# Altium schematic sheet bb_Nucleo.SchDoc
size A4; SheetNumber: 1; SheetTotal: 6
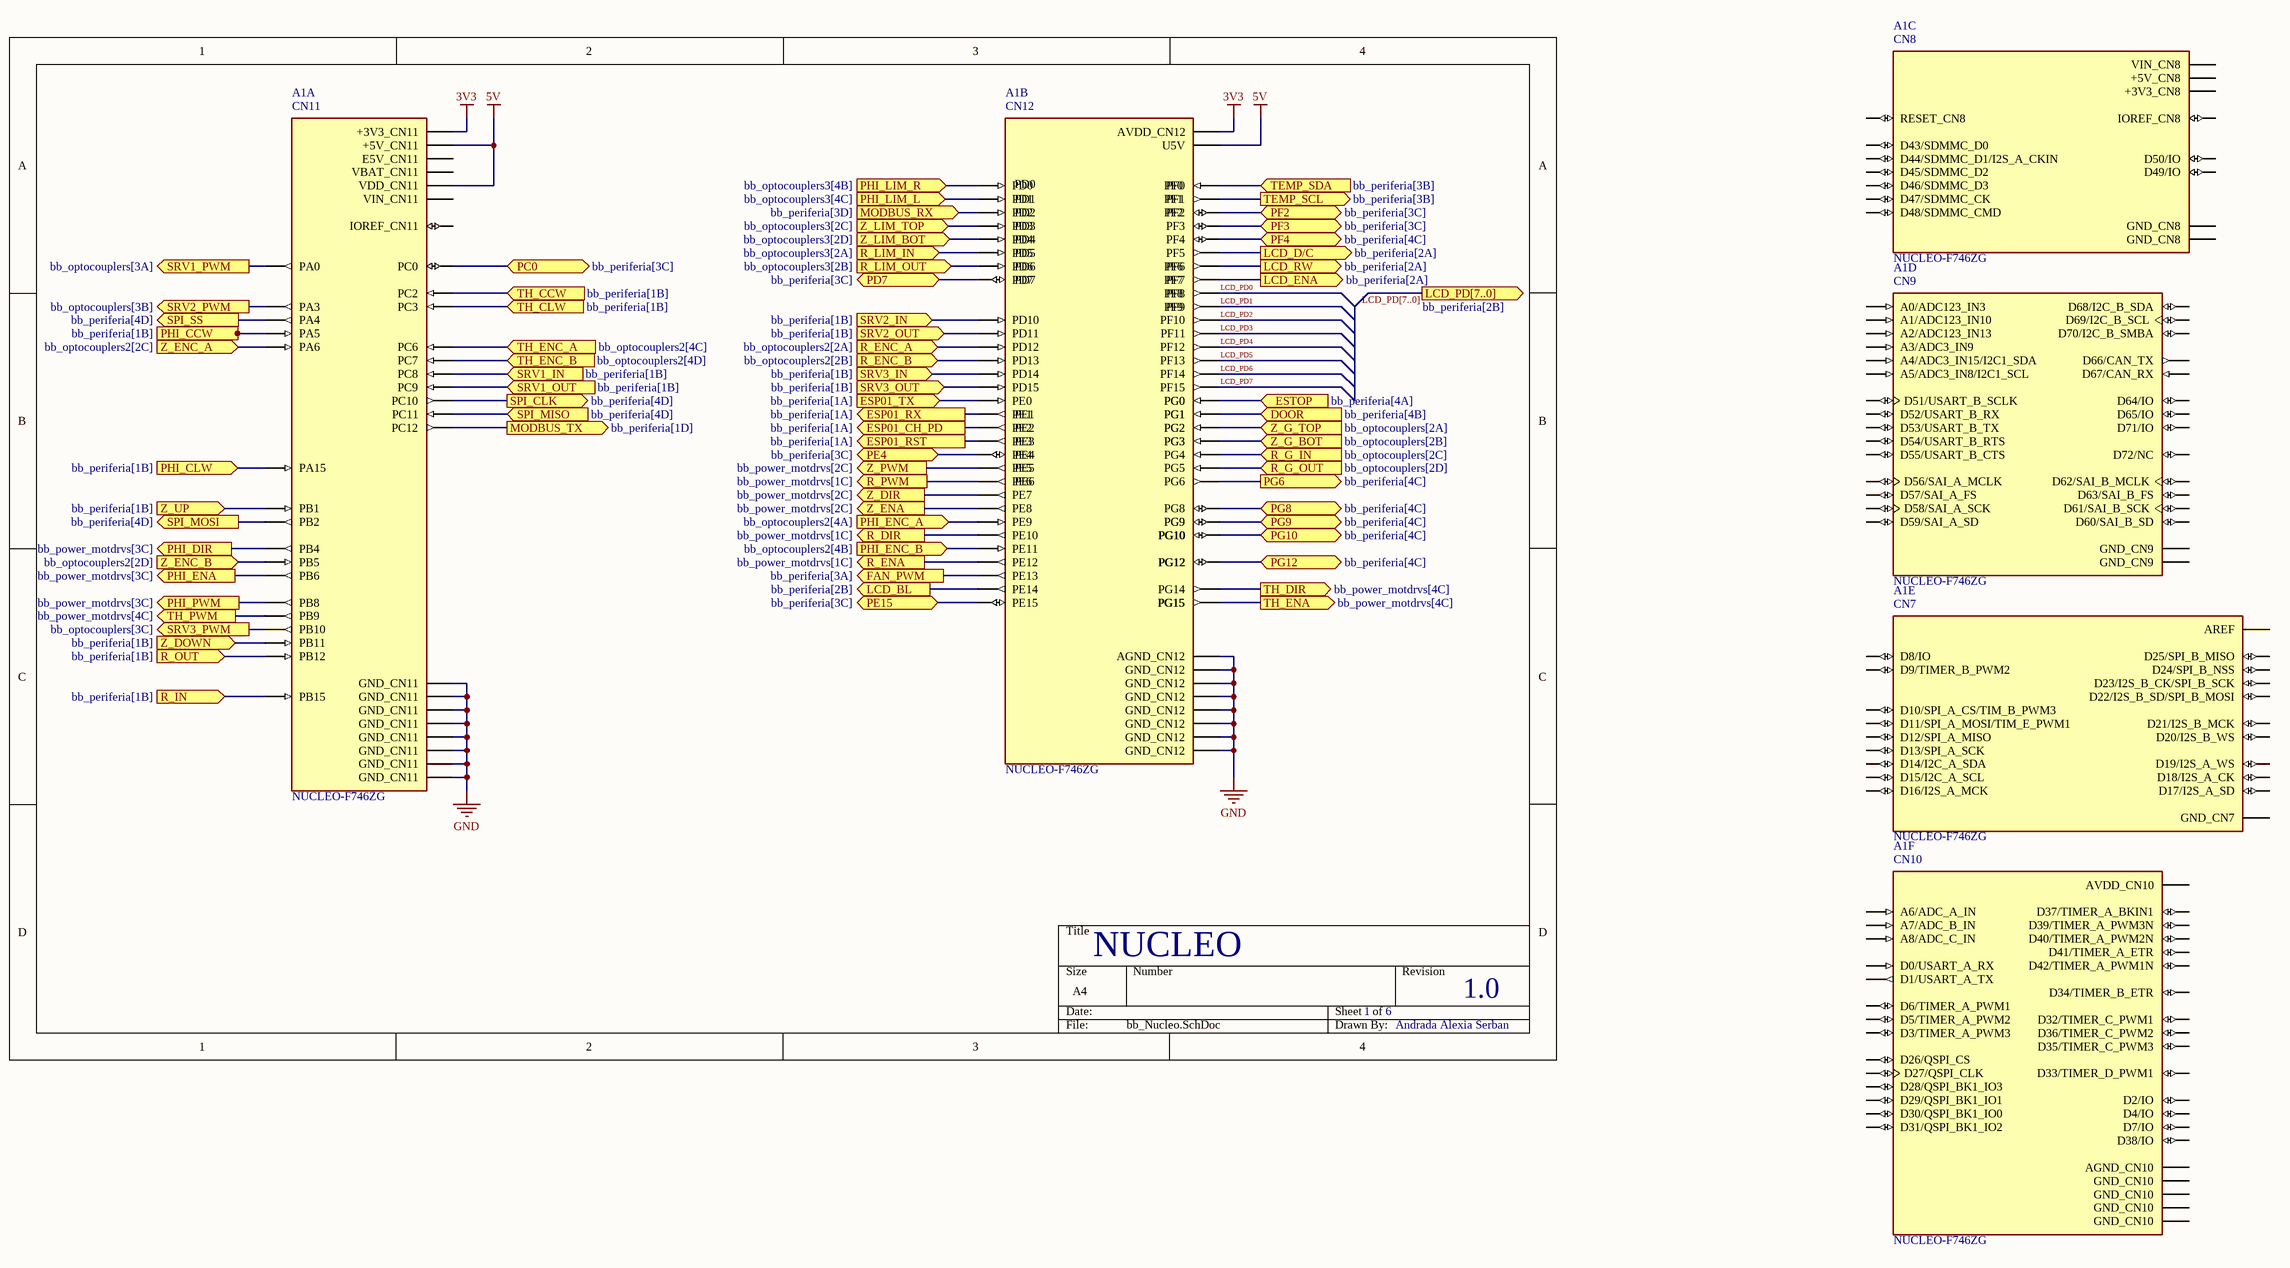
[diagram p0: bb_Nucleo.SchDoc]

## Parts
A1  NUCLEO-F746ZG  [MODULE_NUCLEO-F746ZG]  (parts A,B,C,D,E,F of 6)

## Ports
DOOR (in, see bb_periferia[4B]), ESP01_CH_PD (out, see bb_periferia[1A]), ESP01_RST (out, see bb_periferia[1A]), ESP01_RX (out, see bb_periferia[1A]), ESP01_TX (in, see bb_periferia[1A]), ESTOP (in, see bb_periferia[4A]), FAN_PWM (out, see bb_periferia[3A]), LCD_BL (out, see bb_periferia[2B]), LCD_D/C (out, see bb_periferia[2A]), LCD_ENA (out, see bb_periferia[2A]), LCD_PD[7..0] (out, see bb_periferia[2B]), LCD_RW (out, see bb_periferia[2A]), MODBUS_RX (in, see bb_periferia[3D]), MODBUS_TX (out, see bb_periferia[1D]), PC0 (bidir, see bb_periferia[3C]), PD7 (bidir, see bb_periferia[3C]), PE4 (bidir, see bb_periferia[3C]), PE15 (bidir, see bb_periferia[3C]), PF2 (bidir, see bb_periferia[3C]), PF3 (bidir, see bb_periferia[3C]), PF4 (bidir, see bb_periferia[4C]), PG6 (out, see bb_periferia[4C]), PG8 (bidir, see bb_periferia[4C]), PG9 (bidir, see bb_periferia[4C]), PG10 (bidir, see bb_periferia[4C]), PG12 (bidir, see bb_periferia[4C]), PHI_CCW (in, see bb_periferia[1B]), PHI_CLW (in, see bb_periferia[1B]), PHI_DIR (out, see bb_power_motdrvs[3C]), PHI_ENA (out, see bb_power_motdrvs[3C]), PHI_ENC_A (in, see bb_optocouplers2[4A]), PHI_ENC_B (in, see bb_optocouplers2[4B]), PHI_LIM_L (in, see bb_optocouplers3[4C]), PHI_LIM_R (in, see bb_optocouplers3[4B]), PHI_PWM (out, see bb_power_motdrvs[3C]), R_DIR (out, see bb_power_motdrvs[1C]), R_ENA (out, see bb_power_motdrvs[1C]), R_ENC_A (in, see bb_optocouplers2[2A]), R_ENC_B (in, see bb_optocouplers2[2B]), R_G_IN (in, see bb_optocouplers[2C]), R_G_OUT (in, see bb_optocouplers[2D]), R_IN (in, see bb_periferia[1B]), R_LIM_IN (in, see bb_optocouplers3[2A]), R_LIM_OUT (in, see bb_optocouplers3[2B]), R_OUT (in, see bb_periferia[1B]), R_PWM (out, see bb_power_motdrvs[1C]), SPI_CLK (out, see bb_periferia[4D]), SPI_MISO (in, see bb_periferia[4D]), SPI_MOSI (out, see bb_periferia[4D]), SPI_SS (out, see bb_periferia[4D]), SRV1_IN (in, see bb_periferia[1B]), SRV1_OUT (in, see bb_periferia[1B]), SRV1_PWM (out, see bb_optocouplers[3A]), SRV2_IN (in, see bb_periferia[1B]), SRV2_OUT (in, see bb_periferia[1B]), SRV2_PWM (out, see bb_optocouplers[3B]), SRV3_IN (in, see bb_periferia[1B]), SRV3_OUT (in, see bb_periferia[1B]), SRV3_PWM (out, see bb_optocouplers[3C]), TEMP_SCL (out, see bb_periferia[3B]), TEMP_SDA (in, see bb_periferia[3B]), TH_CCW (in, see bb_periferia[1B]), TH_CLW (in, see bb_periferia[1B]), TH_DIR (out, see bb_power_motdrvs[4C]), TH_ENA (out, see bb_power_motdrvs[4C]), TH_ENC_A (in, see bb_optocouplers2[4C]), TH_ENC_B (in, see bb_optocouplers2[4D]), TH_PWM (out, see bb_power_motdrvs[4C]), Z_DIR (out, see bb_power_motdrvs[2C]), Z_DOWN (in, see bb_periferia[1B]), Z_ENA (out, see bb_power_motdrvs[2C]), Z_ENC_A (in, see bb_optocouplers2[2C]), Z_ENC_B (in, see bb_optocouplers2[2D]), Z_G_BOT (in, see bb_optocouplers[2B]), Z_G_TOP (in, see bb_optocouplers[2A]), Z_LIM_BOT (in, see bb_optocouplers3[2D]), Z_LIM_TOP (in, see bb_optocouplers3[2C]), Z_PWM (out, see bb_power_motdrvs[2C]), Z_UP (in, see bb_periferia[1B])

## Nets
3V3: A1.CN11_16(+3V3_CN11) A1.CN12_7(AVDD_CN12)
5V: A1.CN11_5(VDD_CN11) A1.CN11_18(+5V_CN11) A1.CN12_8(U5V)
GND: A1.CN11_8(GND_CN11) A1.CN11_19(GND_CN11) A1.CN11_20(GND_CN11) A1.CN11_22(GND_CN11) A1.CN11_49(GND_CN11) A1.CN11_60(GND_CN11) A1.CN11_71(GND_CN11) A1.CN11_72(GND_CN11) A1.CN12_9(GND_CN12) A1.CN12_20(GND_CN12) A1.CN12_32(AGND_CN12) A1.CN12_39(GND_CN12) A1.CN12_54(GND_CN12) A1.CN12_63(GND_CN12) A1.CN12_71(GND_CN12) A1.CN12_72(GND_CN12)
DOOR: A1.CN11_58(PG1) ; port DOOR
ESP01_CH_PD: A1.CN11_46(PE2) ; port ESP01_CH_PD
ESP01_RST: A1.CN11_47(PE3) ; port ESP01_RST
ESP01_RX: A1.CN11_61(PE1) ; port ESP01_RX
ESP01_TX: A1.CN12_64(PE0) ; port ESP01_TX
ESTOP: A1.CN11_59(PG0) ; port ESTOP
FAN_PWM: A1.CN12_55(PE13) ; port FAN_PWM
LCD_BL: A1.CN12_51(PE14) ; port LCD_BL
LCD_D/C: A1.CN12_36(PF5) ; port LCD_D/C
LCD_ENA: A1.CN11_11(PF7) ; port LCD_ENA
LCD_PD0: A1.CN11_54(PF8)
LCD_PD1: A1.CN11_56(PF9)
LCD_PD2: A1.CN12_42(PF10)
LCD_PD3: A1.CN12_62(PF11)
LCD_PD4: A1.CN12_59(PF12)
LCD_PD5: A1.CN12_57(PF13)
LCD_PD6: A1.CN12_50(PF14)
LCD_PD7: A1.CN12_60(PF15)
LCD_RW: A1.CN11_9(PF6) ; port LCD_RW
MODBUS_RX: A1.CN11_4(PD2) ; port MODBUS_RX
MODBUS_TX: A1.CN11_3(PC12) ; port MODBUS_TX
PC0: A1.CN11_38(PC0) ; port PC0
PD7: A1.CN11_45(PD7) ; port PD7
PE4: A1.CN11_48(PE4) ; port PE4
PE15: A1.CN12_53(PE15) ; port PE15
PF2: A1.CN11_52(PF2) ; port PF2
PF3: A1.CN12_58(PF3) ; port PF3
PF4: A1.CN12_38(PF4) ; port PF4
PG6: A1.CN12_70(PG6) ; port PG6
PG8: A1.CN12_66(PG8) ; port PG8
PG9: A1.CN11_63(PG9) ; port PG9
PG10: A1.CN11_66(PG10) ; port PG10
PG12: A1.CN11_65(PG12) ; port PG12
PHI_CCW: A1.CN12_11(PA5) ; port PHI_CCW
PHI_CLW: A1.CN11_17(PA15) ; port PHI_CLW
PHI_DIR: A1.CN12_27(PB4) ; port PHI_DIR
PHI_ENA: A1.CN12_17(PB6) ; port PHI_ENA
PHI_ENC_A: A1.CN12_52(PE9) ; port PHI_ENC_A
PHI_ENC_B: A1.CN12_56(PE11) ; port PHI_ENC_B
PHI_LIM_L: A1.CN11_55(PD1) ; port PHI_LIM_L
PHI_LIM_R: A1.CN11_57(PD0) ; port PHI_LIM_R
PHI_PWM: A1.CN12_3(PB8) ; port PHI_PWM
R_DIR: A1.CN12_47(PE10) ; port R_DIR
R_ENA: A1.CN12_49(PE12) ; port R_ENA
R_ENC_A: A1.CN12_43(PD12) ; port R_ENC_A
R_ENC_B: A1.CN12_41(PD13) ; port R_ENC_B
R_G_IN: A1.CN12_69(PG4) ; port R_G_IN
R_G_OUT: A1.CN12_68(PG5) ; port R_G_OUT
R_IN: A1.CN12_26(PB15) ; port R_IN
R_LIM_IN: A1.CN11_41(PD5) ; port R_LIM_IN
R_LIM_OUT: A1.CN11_43(PD6) ; port R_LIM_OUT
R_OUT: A1.CN12_16(PB12) ; port R_OUT
R_PWM: A1.CN11_62(PE6) ; port R_PWM
SPI_CLK: A1.CN11_1(PC10) ; port SPI_CLK
SPI_MISO: A1.CN11_2(PC11) ; port SPI_MISO
SPI_MOSI: A1.CN12_22(PB2) ; port SPI_MOSI
SPI_SS: A1.CN11_32(PA4) ; port SPI_SS
SRV1_IN: A1.CN12_2(PC8) ; port SRV1_IN
SRV1_OUT: A1.CN12_1(PC9) ; port SRV1_OUT
SRV1_PWM: A1.CN11_28(PA0) ; port SRV1_PWM
SRV2_IN: A1.CN12_65(PD10) ; port SRV2_IN
SRV2_OUT: A1.CN12_45(PD11) ; port SRV2_OUT
SRV2_PWM: A1.CN12_37(PA3) ; port SRV2_PWM
SRV3_IN: A1.CN12_46(PD14) ; port SRV3_IN
SRV3_OUT: A1.CN12_48(PD15) ; port SRV3_OUT
SRV3_PWM: A1.CN12_25(PB10) ; port SRV3_PWM
TEMP_SCL: A1.CN11_51(PF1) ; port TEMP_SCL
TEMP_SDA: A1.CN11_53(PF0) ; port TEMP_SDA
TH_CCW: A1.CN11_35(PC2) ; port TH_CCW
TH_CLW: A1.CN11_37(PC3) ; port TH_CLW
TH_DIR: A1.CN12_61(PG14) ; port TH_DIR
TH_ENA: A1.CN11_64(PG15) ; port TH_ENA
TH_ENC_A: A1.CN12_4(PC6) ; port TH_ENC_A
TH_ENC_B: A1.CN12_19(PC7) ; port TH_ENC_B
TH_PWM: A1.CN12_5(PB9) ; port TH_PWM
Z_DIR: A1.CN12_44(PE7) ; port Z_DIR
Z_DOWN: A1.CN12_18(PB11) ; port Z_DOWN
Z_ENA: A1.CN12_40(PE8) ; port Z_ENA
Z_ENC_A: A1.CN12_13(PA6) ; port Z_ENC_A
Z_ENC_B: A1.CN12_29(PB5) ; port Z_ENC_B
Z_G_BOT: A1.CN11_44(PG3) ; port Z_G_BOT
Z_G_TOP: A1.CN11_42(PG2) ; port Z_G_TOP
Z_LIM_BOT: A1.CN11_39(PD4) ; port Z_LIM_BOT
Z_LIM_TOP: A1.CN11_40(PD3) ; port Z_LIM_TOP
Z_PWM: A1.CN11_50(PE5) ; port Z_PWM
Z_UP: A1.CN12_24(PB1) ; port Z_UP

Not connected (* = marked no-connect by the designer): A1 CN7_1(D16/I2S_A_MCK) CN7_2(D15/I2C_A_SCL) CN7_3(D17/I2S_A_SD) CN7_4(D14/I2C_A_SDA) CN7_5(D18/I2S_A_CK) CN7_6(AREF) CN7_7(D19/I2S_A_WS) CN7_8(GND_CN7) CN7_9(D20/I2S_B_WS) CN7_10(D13/SPI_A_SCK) CN7_11(D21/I2S_B_MCK) CN7_12(D12/SPI_A_MISO) CN7_13(D22/I2S_B_SD/SPI_B_MOSI) CN7_14(D11/SPI_A_MOSI/TIM_E_PWM1) CN7_15(D23/I2S_B_CK/SPI_B_SCK) CN7_16(D10/SPI_A_CS/TIM_B_PWM3) CN7_17(D24/SPI_B_NSS) CN7_18(D9/TIMER_B_PWM2) CN7_19(D25/SPI_B_MISO) CN7_20(D8/IO) CN8_2(D43/SDMMC_D0) CN8_3(IOREF_CN8) CN8_4(D44/SDMMC_D1/I2S_A_CKIN) CN8_5(RESET_CN8) CN8_6(D45/SDMMC_D2) CN8_7(+3V3_CN8) CN8_8(D46/SDMMC_D3) CN8_9(+5V_CN8) CN8_10(D47/SDMMC_CK) CN8_11(GND_CN8) CN8_12(D48/SDMMC_CMD) CN8_13(GND_CN8) CN8_14(D49/IO) CN8_15(VIN_CN8) CN8_16(D50/IO) CN9_1(A0/ADC123_IN3) CN9_2(D51/USART_B_SCLK) CN9_3(A1/ADC123_IN10) CN9_4(D52/USART_B_RX) CN9_5(A2/ADC123_IN13) CN9_6(D53/USART_B_TX) CN9_7(A3/ADC3_IN9) CN9_8(D54/USART_B_RTS) CN9_9(A4/ADC3_IN15/I2C1_SDA) CN9_10(D55/USART_B_CTS) CN9_11(A5/ADC3_IN8/I2C1_SCL) CN9_12(GND_CN9) CN9_13(D72/NC) CN9_14(D56/SAI_A_MCLK) CN9_15(D71/IO) CN9_16(D57/SAI_A_FS) CN9_17(D70/I2C_B_SMBA) CN9_18(D58/SAI_A_SCK) CN9_19(D69/I2C_B_SCL) CN9_20(D59/SAI_A_SD) CN9_21(D68/I2C_B_SDA) CN9_22(D60/SAI_B_SD) CN9_23(GND_CN9) CN9_24(D61/SAI_B_SCK) CN9_25(D67/CAN_RX) CN9_26(D62/SAI_B_MCLK) CN9_27(D66/CAN_TX) CN9_28(D63/SAI_B_FS) CN9_29(D65/IO) CN9_30(D64/IO) CN10_1(AVDD_CN10) CN10_2(D7/IO) CN10_3(AGND_CN10) CN10_4(D6/TIMER_A_PWM1) CN10_5(GND_CN10) CN10_6(D5/TIMER_A_PWM2) CN10_7(A6/ADC_A_IN) CN10_8(D4/IO) CN10_9(A7/ADC_B_IN) CN10_10(D3/TIMER_A_PWM3) CN10_11(A8/ADC_C_IN) CN10_12(D2/IO) CN10_13(D26/QSPI_CS) CN10_14(D1/USART_A_TX) CN10_15(D27/QSPI_CLK) CN10_16(D0/USART_A_RX) CN10_17(GND_CN10) CN10_18(D42/TIMER_A_PWM1N) CN10_19(D28/QSPI_BK1_IO3) CN10_20(D41/TIMER_A_ETR) CN10_21(D29/QSPI_BK1_IO1) CN10_22(GND_CN10) CN10_23(D30/QSPI_BK1_IO0) CN10_24(D40/TIMER_A_PWM2N) CN10_25(D31/QSPI_BK1_IO2) CN10_26(D39/TIMER_A_PWM3N) CN10_27(GND_CN10) CN10_28(D38/IO) CN10_29(D32/TIMER_C_PWM1) CN10_30(D37/TIMER_A_BKIN1) CN10_31(D33/TIMER_D_PWM1) CN10_32(D36/TIMER_C_PWM2) CN10_33(D34/TIMER_B_ETR) CN10_34(D35/TIMER_C_PWM3) CN11_6(E5V_CN11) CN11_7(BOOT0) CN11_12(IOREF_CN11) CN11_13(PA13) CN11_14(RESET_CN11) CN11_15(PA14) CN11_21(PB7) CN11_23(PC13) CN11_24(VIN_CN11) CN11_25(PC14) CN11_27(PC15) CN11_29(PH0) CN11_30(PA1) CN11_31(PH1) CN11_33(VBAT_CN11) CN11_34(PB0) CN11_36(PC1) CN11_68(PG13) CN11_69(PD9) CN11_70(PG11) CN12_6(PC5) CN12_10(PD8) CN12_12(PA12) CN12_14(PA11) CN12_15(PA7) CN12_21(PA9) CN12_23(PA8) CN12_28(PB14) CN12_30(PB13) CN12_31(PB3) CN12_33(PA10) CN12_34(PC4) CN12_35(PA2) CN12_67(PG7)

## Buses and harness runs
bus LCD_PD[7..0]

## Notes on the sheet
- (near A1) PD0
- (near A1) PD1
- (near A1) PD2
- (near A1) PF0
- (near A1) PF1
- (near A1) PF2
- (near A1) PD3
- (near A1) PD4
- (near A1) PD5
- (near A1) PD6
- (near A1) PD7
- (near A1) PF6
- (near A1) PF7
- (near A1) PF8
- (near A1) PF9
- (near A1) PE1
- (near A1) PG0
- (near A1) PG1
- (near A1) PE2
- (near A1) PE3
- (near A1) PE4
- (near A1) PE5
- (near A1) PE6
- (near A1) PG2
- (near A1) PG3
- (near A1) PG10
- (near A1) PG9
- (near A1) PG15
- (near A1) PG12
- NUCLEO
- 1
- 6
- 1.0
- Andrada Alexia Serban
- Labels drawn without touching a wire or pin: LCD_PD[7..0]
- (in symbol CMP-015-000000-1, part A) CN11
- (in symbol CMP-015-000000-1, part B) CN12
- (in symbol CMP-015-000000-1, part C) CN8
- (in symbol CMP-015-000000-1, part D) CN9
- (in symbol CMP-015-000000-1, part E) CN7
- (in symbol CMP-015-000000-1, part F) CN10

## Library data of the parts
A1 = CMP-015-000000-1: STM32F746ZG, mbed-Enabled Development Nucleo-144 STM32F7 ARMÂ® CortexÂ®-M7 MCU 32-Bit Embedded Evaluation Board; MF: STMicroelectronics; Purchase-URL: https://pricing.snapeda.com/search/part/NUCLEO-F746ZG/?ref=eda; MP: NUCLEO-F746ZG; Design Item ID: NUCLEO-F746ZG; Pin Count: 240; Component Type: Standard; SnapEDA_Link: https://www.snapeda.com/parts/NUCLEO-F746ZG/STMicroelectronics/view-part/531935/?ref=snap; Source: NUCLEO-F746ZG.SchLib; Check_prices: https://www.snapeda.com/parts/NUCLEO-F746ZG/STMicroelectronics/view-part/531935/?ref=eda; Package: None; Price: None; Value: *; Availability: Warning